# EAGLE schematic dover (EAGLE 6.4)
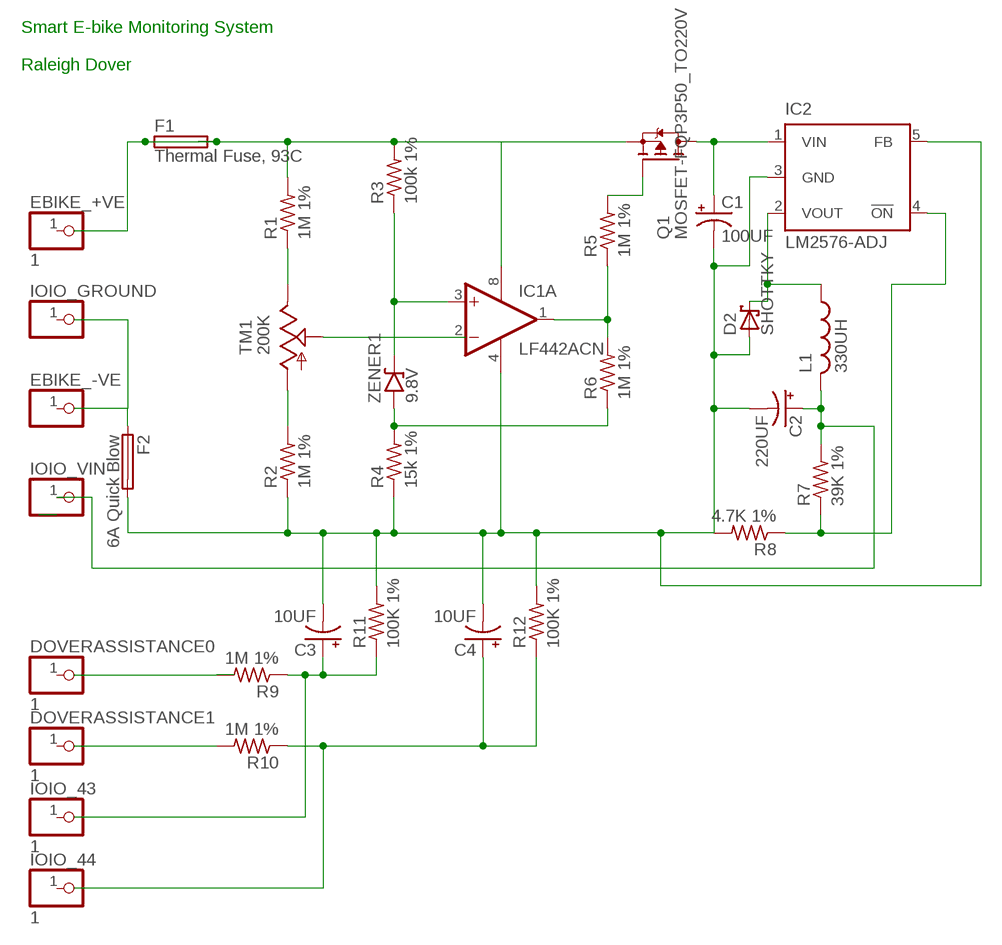
[diagram p0: schematic, sheet 1]

## Parts
C1  100UF  CPOL-USD  [PANASONIC_D]
C2  220UF  CPOL-USD  [PANASONIC_D]
C3  10UF  CPOL-USD  [PANASONIC_D]
C4  10UF  CPOL-USD  [PANASONIC_D]
D2  SHOTTKY  SCHOTTKY-DIODECB417-15  [CB417-15]
DOVERASSISTANCE0  1  PINHD-1X1  [1X01]
DOVERASSISTANCE1  1  PINHD-1X1  [1X01]
EBIKE_+VE  1  PINHD-1X1  [1X01]
EBIKE_-VE  PINHD-1X1  [1X01]
F1  Thermal Fuse, 93C  FUSELITTLEFUSE  [LITTLEFUSE]
F2  6A Quick Blow  FUSELITTLEFUSE  [LITTLEFUSE]
IC1  LF442ACN  LM358N  [DIL08]
IC2  LM2576-ADJ  TPS77001  [SOT23-DBV]
IOIO_43  1  PINHD-1X1  [1X01]
IOIO_44  1  PINHD-1X1  [1X01]
IOIO_GROUND  PINHD-1X1  [1X01]
IOIO_VIN  PINHD-1X1  [1X01]
L1  330UH  L  [6000]
Q1  MOSFET-FQP3P50_TO220V  MOSFET-PGDS_TO220V  [TO220V]
R1  1M 1%  R-US_0414/15  [0414/15]
R2  1M 1%  R-US_0414/15  [0414/15]
R3  100k 1%  R-US_0414/15  [0414/15]
R4  15k 1%  R-US_0414/15  [0414/15]
R5  1M 1%  R-US_0414/15  [0414/15]
R6  1M 1%  R-US_0414/15  [0414/15]
R7  39K 1%  R-US_0414/15  [0414/15]
R8  4.7K 1%  R-US_0414/15  [0414/15]
R9  1M 1%  R-US_0414/15  [0414/15]
R10  1M 1%  R-US_0414/15  [0414/15]
R11  100K 1%  R-US_0414/15  [0414/15]
R12  100K 1%  R-US_0414/15  [0414/15]
TM1  200K  TRIM  [6MM]
ZENER1  9.8V  1N9ZENER  [DO35-3]

## Nets
93C: F1.1 F1.2 IC1.8(P:V+) Q1.3(S) R1.2 R3.2
N$1: R1.1 TM1.E
N$2: Q1.1(G) R5.2
N$3: R2.2 TM1.A
N$4: C3.- C4.- F2.2 IC1.4(P:V-) IC2.5(FB) R2.1 R4.1 R8.2 R11.2 R12.2
N$5: TM1.S
N$6: IC1.3(A:+IN) R3.1 ZENER1.C
N$7: R4.2 R6.1 ZENER1.A
N$8: C1.+ IC2.1(VIN) Q1.2(D)
N$9: IC1.1(A:OUT) R5.1 R6.2
N$10: F2.1
N$11: C1.- C2.- D2.A IC2.3(GND)
N$12: C2.+ L1.2 R7.2
N$13: D2.C IC2.2(VOUT) L1.1
N$14: C4.+ R12.1
N$15: R10.2
N$16: IC2.4(!ON) R7.1 R8.1
N$18: C3.+ R9.1 R11.1
Unconnected: DOVERASSISTANCE0.1 DOVERASSISTANCE1.1 EBIKE_+VE.1 EBIKE_-VE.1 IC1.2(A:-IN) IC1.5(B:+IN) IC1.6(B:-IN) IC1.7(B:OUT) IOIO_43.1 IOIO_44.1 IOIO_GROUND.1 IOIO_VIN.1 R9.2 R10.1

## Notes on the sheet
- Smart E-bike Monitoring System
  
  Raleigh Dover

## Library data of the parts
C1-C4 = adafruit:CPOL-US: POLARIZED CAPACITOR, American symbol
D2 = adafruit:SCHOTTKY-DIODE: Schottky Diode
DOVERASSISTANCE0 DOVERASSISTANCE1 EBIKE_+VE EBIKE_-VE IOIO_43 IOIO_44 IOIO_GROUND IOIO_VIN = adafruit:PINHD-1X1: Pin header 1x1 for 0.1" spacing With round pins
F1 F2 = fuse:FUSE: Fuse; OC_FARNELL: unknown; OC_NEWARK: unknown
IC1 = linear:LM358: OP AMP also LM158; LM258; LM2904 Source: http://cache.national.com/ds/LM/LM158.pdf
IC2 = lm2576_ck:TPS770*: ULTRALOW-POWER 50-mA LOW-DROPOUT LINEAR REGULATORS 50-mA Low-Dropout Regulator Source: http://focus.ti.com/lit/ds/symlink/tps77001.pdf; MF: TEXAS INSTRUMENTS; MPN: TPS77001DBVT; OC_FARNELL: 8461554; OC_NEWARK: 77C1171
L1 = adafruit:L
Q1 = adafruit:MOSFET-P
R1-R12 = adafruit:R-US_: RESISTOR, American symbol
TM1 = adafruit:TRIM
ZENER1 = gm-diodes:1N9*ZENER: 1N9???B Zener Diode DO-35 case 1N957B - 1N992B (6.8V to 200V)